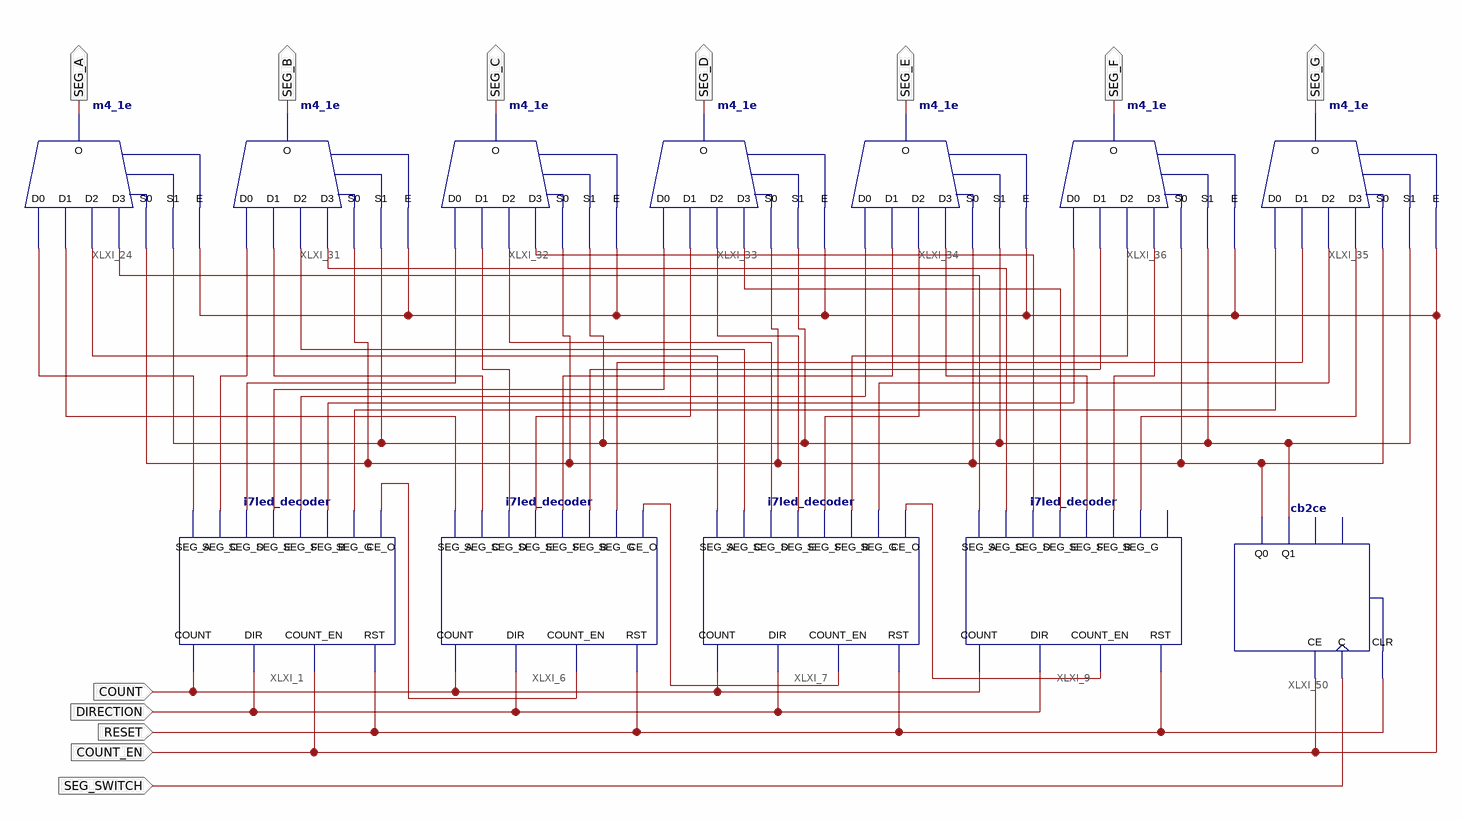
[diagram p0: schematic sheet 1]
// Xilinx ISE schematic Setter.sch (spartan6) as structural Verilog: 12 symbols, 12 ports
module Setter (
  input  DIRECTION,
  input  COUNT,
  input  RESET,
  input  COUNT_EN,
  input  SEG_SWITCH,
  output SEG_A,
  output SEG_B,
  output SEG_C,
  output SEG_D,
  output SEG_E,
  output SEG_F,
  output SEG_G
);

  wire XLXN_30, XLXN_31, XLXN_32, XLXN_33, XLXN_34, XLXN_35, XLXN_36, XLXN_37, XLXN_38, XLXN_39, XLXN_40,
       XLXN_41, XLXN_42, XLXN_43, XLXN_44, XLXN_45, XLXN_46, XLXN_47, XLXN_48, XLXN_49, XLXN_50, XLXN_51,
       XLXN_52, XLXN_53, XLXN_54, XLXN_55, XLXN_56, XLXN_57, XLXN_63, XLXN_65, XLXN_71, XLXN_84, XLXN_85;

  i7led_decoder XLXI_1 (
    .COUNT(COUNT), .DIR(DIRECTION), .COUNT_EN(COUNT_EN), .RST(RESET), .SEG_A(XLXN_30), .SEG_C(XLXN_31),
    .SEG_D(XLXN_32), .SEG_E(XLXN_33), .SEG_F(XLXN_34), .SEG_B(XLXN_35), .SEG_G(XLXN_36), .CE_O(XLXN_63));
  i7led_decoder XLXI_6 (
    .COUNT(COUNT), .DIR(DIRECTION), .COUNT_EN(XLXN_63), .RST(RESET), .SEG_A(XLXN_37), .SEG_C(XLXN_38),
    .SEG_D(XLXN_39), .SEG_E(XLXN_40), .SEG_F(XLXN_41), .SEG_B(XLXN_42), .SEG_G(XLXN_43), .CE_O(XLXN_65));
  i7led_decoder XLXI_7 (
    .COUNT(COUNT), .DIR(DIRECTION), .COUNT_EN(XLXN_65), .RST(RESET), .SEG_A(XLXN_44), .SEG_C(XLXN_45),
    .SEG_D(XLXN_46), .SEG_E(XLXN_47), .SEG_F(XLXN_48), .SEG_B(XLXN_49), .SEG_G(XLXN_50), .CE_O(XLXN_71));
  i7led_decoder XLXI_9 (
    .COUNT(COUNT), .DIR(DIRECTION), .COUNT_EN(XLXN_71), .RST(RESET), .SEG_A(XLXN_51), .SEG_C(XLXN_52),
    .SEG_D(XLXN_53), .SEG_E(XLXN_54), .SEG_F(XLXN_55), .SEG_B(XLXN_56), .SEG_G(XLXN_57));  // open: CE_O
  m4_1e XLXI_35 (
    .D0(XLXN_36), .D1(XLXN_43), .D2(XLXN_50), .D3(XLXN_57), .E(COUNT_EN), .S0(XLXN_84), .S1(XLXN_85),
    .O(SEG_G));
  m4_1e XLXI_24 (
    .D0(XLXN_30), .D1(XLXN_37), .D2(XLXN_44), .D3(XLXN_51), .E(COUNT_EN), .S0(XLXN_84), .S1(XLXN_85),
    .O(SEG_A));
  m4_1e XLXI_31 (
    .D0(XLXN_31), .D1(XLXN_38), .D2(XLXN_45), .D3(XLXN_52), .E(COUNT_EN), .S0(XLXN_84), .S1(XLXN_85),
    .O(SEG_B));
  m4_1e XLXI_32 (
    .D0(XLXN_32), .D1(XLXN_39), .D2(XLXN_46), .D3(XLXN_53), .E(COUNT_EN), .S0(XLXN_84), .S1(XLXN_85),
    .O(SEG_C));
  m4_1e XLXI_33 (
    .D0(XLXN_33), .D1(XLXN_40), .D2(XLXN_47), .D3(XLXN_54), .E(COUNT_EN), .S0(XLXN_84), .S1(XLXN_85),
    .O(SEG_D));
  m4_1e XLXI_34 (
    .D0(XLXN_34), .D1(XLXN_41), .D2(XLXN_48), .D3(XLXN_55), .E(COUNT_EN), .S0(XLXN_84), .S1(XLXN_85),
    .O(SEG_E));
  m4_1e XLXI_36 (
    .D0(XLXN_35), .D1(XLXN_42), .D2(XLXN_49), .D3(XLXN_56), .E(COUNT_EN), .S0(XLXN_84), .S1(XLXN_85),
    .O(SEG_F));
  cb2ce XLXI_50 (.C(SEG_SWITCH), .CE(COUNT_EN), .CLR(RESET), .Q0(XLXN_84), .Q1(XLXN_85));  // open: CEO, TC
endmodule
